# EasyEDA Pro project 中心板V3.0.epro

# Schematic Schematic1
Board Name: Board1; Create Date: 2024-10-14; Page Name: P1; Project Name: 中心板; Schematic Name: Schematic1; Update Date: 2024-11-11; Company: 嘉立创EDA; Page Size: A4; Version: V1.0
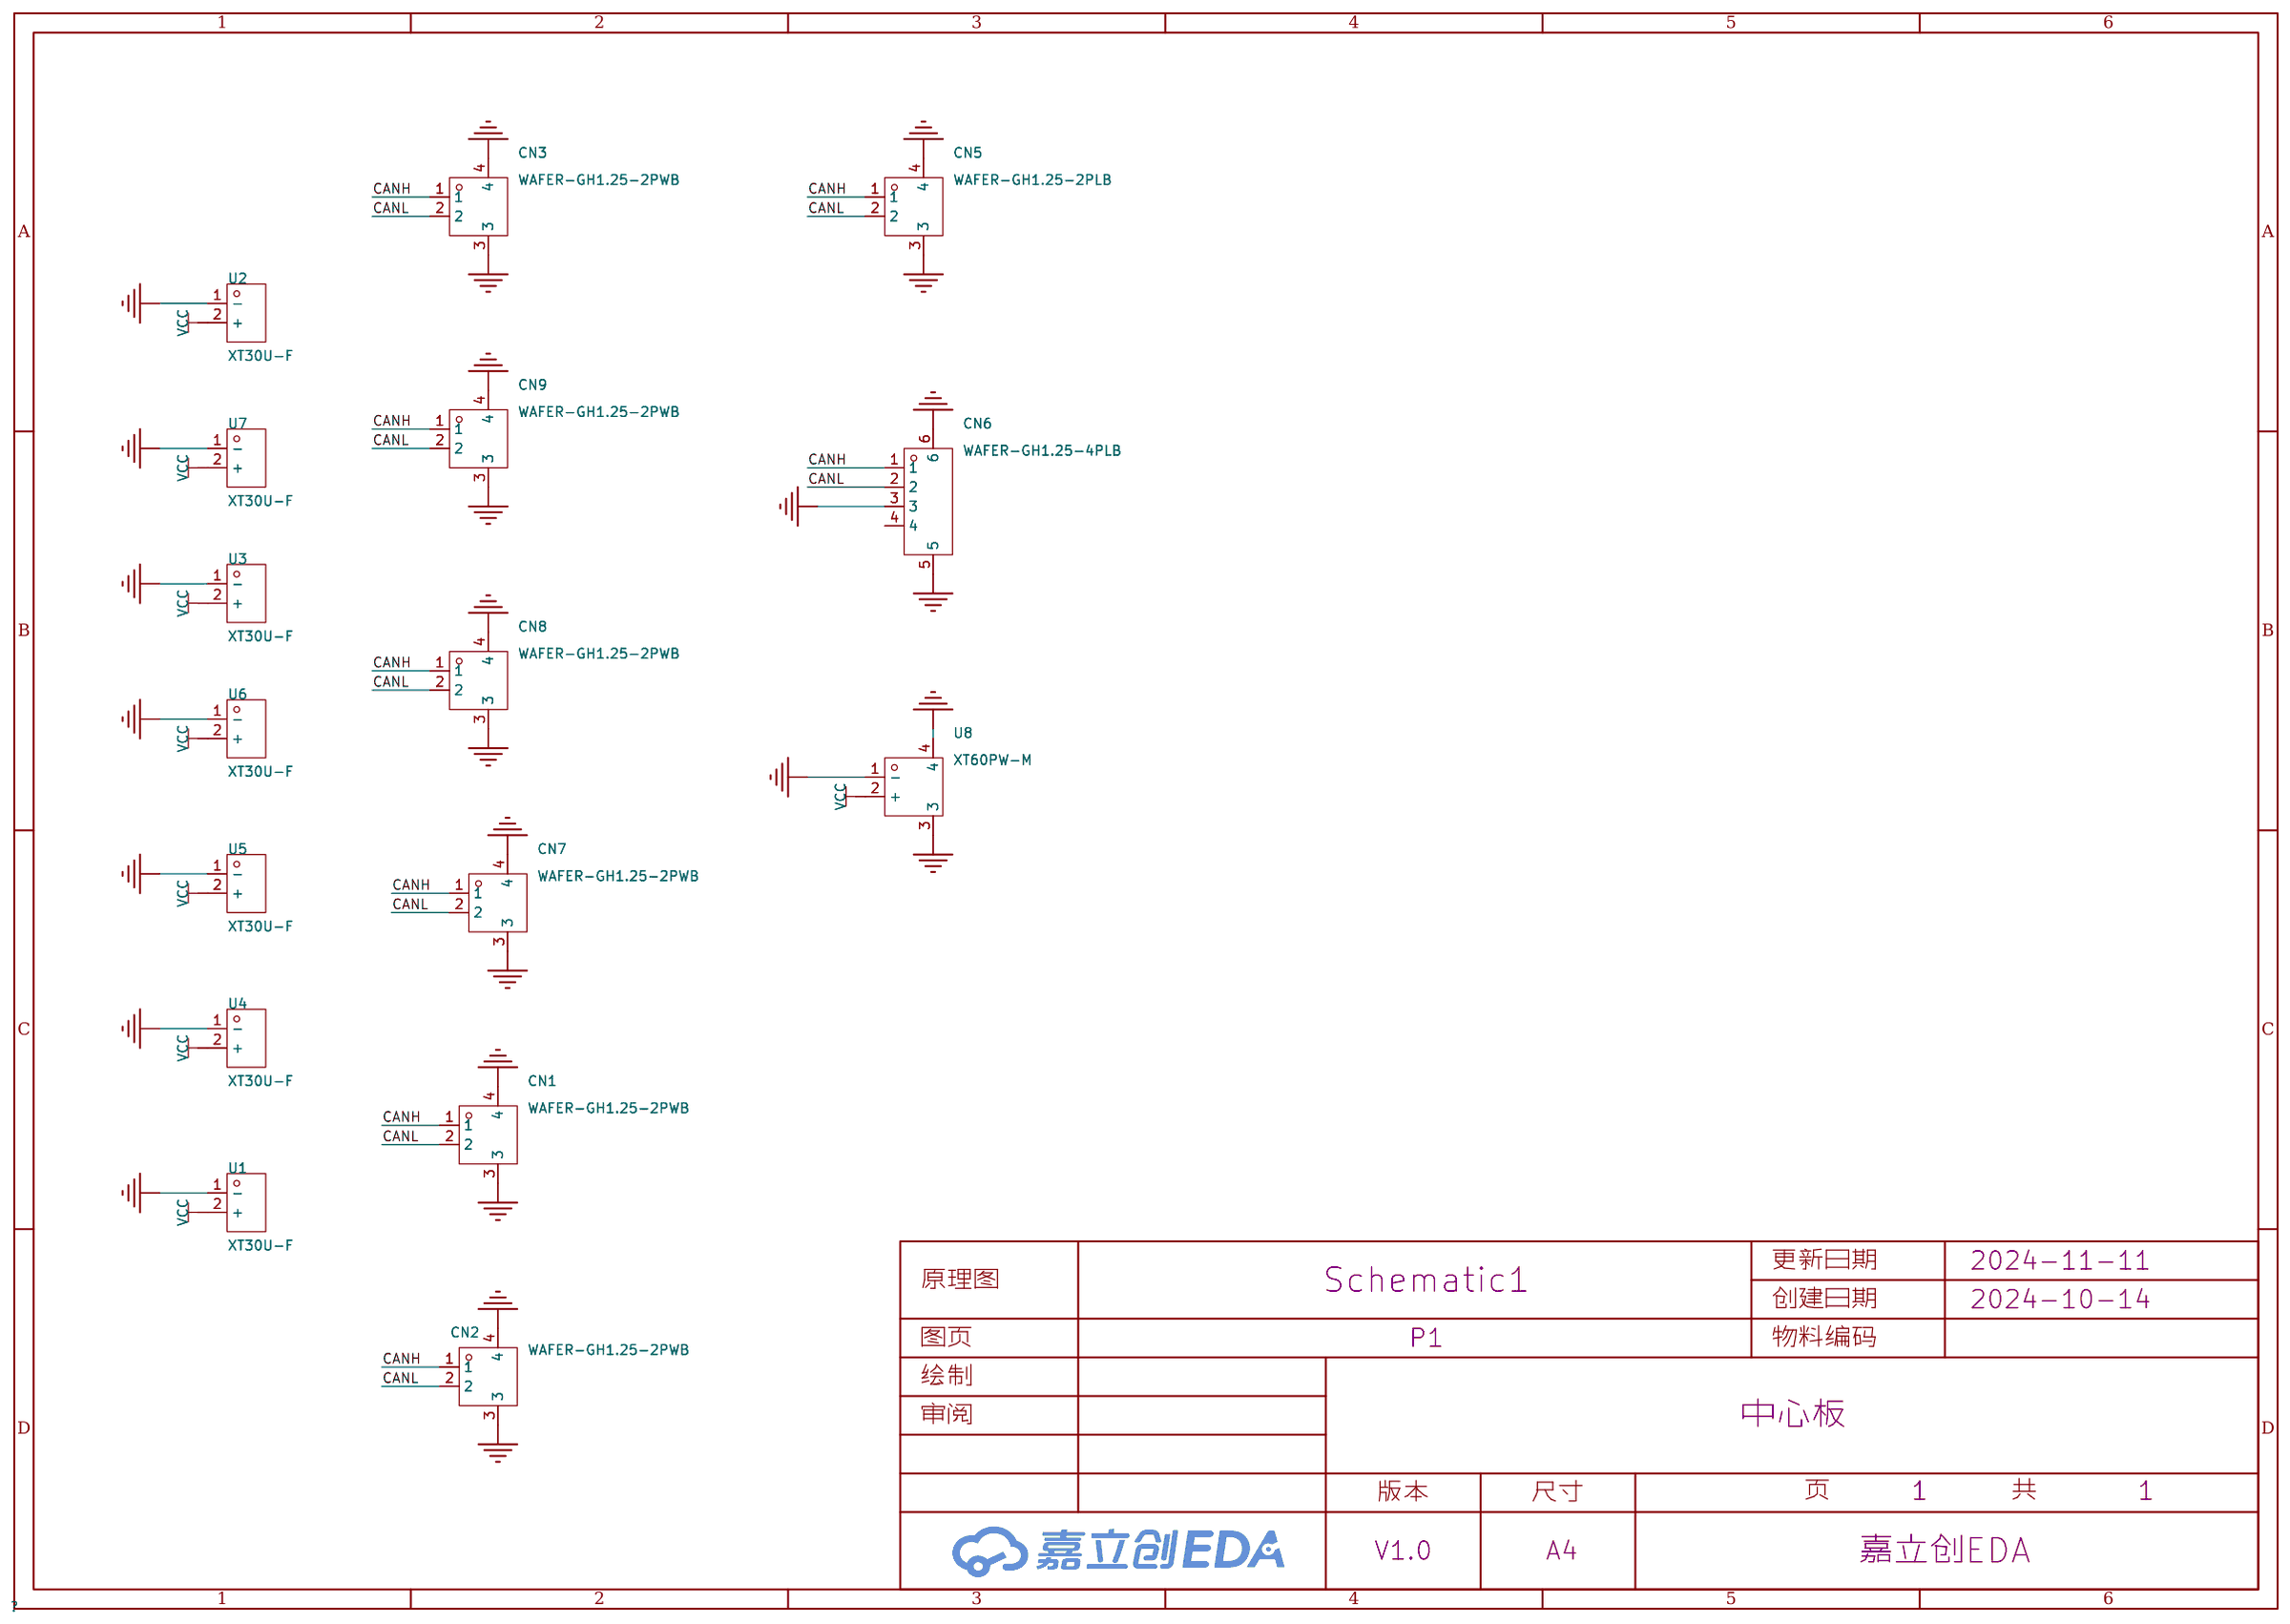
[diagram p0: schematic sheet]

## Parts
CN1  WAFER-GH1.25-2PWB  [CONN-TH_2P-P1.25_XUNPU_WAFER-GH1.25-2PWB]
CN2  WAFER-GH1.25-2PWB  [CONN-TH_2P-P1.25_XUNPU_WAFER-GH1.25-2PWB]
CN3  WAFER-GH1.25-2PWB  [CONN-TH_2P-P1.25_XUNPU_WAFER-GH1.25-2PWB]
CN5  WAFER-GH1.25-2PLB  [CONN-TH_2P-P1.25_XUNPU_WAFER-GH1.25-2PLB]
CN6  WAFER-GH1.25-4PLB  [CONN-SMD_4P-P1.25_XUNPU_WAFER-GH1.25-4PLB]
CN7  WAFER-GH1.25-2PWB  [CONN-TH_2P-P1.25_XUNPU_WAFER-GH1.25-2PWB]
CN8  WAFER-GH1.25-2PWB  [CONN-TH_2P-P1.25_XUNPU_WAFER-GH1.25-2PWB]
CN9  WAFER-GH1.25-2PWB  [CONN-TH_2P-P1.25_XUNPU_WAFER-GH1.25-2PWB]
U1  XT30U-F  [CONN-TH_XT30U-F]
U2  XT30U-F  [CONN-TH_XT30U-F]
U3  XT30U-F  [CONN-TH_XT30U-F]
U4  XT30U-F  [CONN-TH_XT30U-F]
U5  XT30U-F  [CONN-TH_XT30U-F]
U6  XT30U-F  [CONN-TH_XT30U-F]
U7  XT30U-F  [CONN-TH_XT30U-F]
U8  XT60PW-M  [CONN-TH_XT60PW-M]

## Library data of the parts
CN1-CN3 CN7-CN9 = WAFER-GH1.25-2PWB: 插针结构:1x2P;间距:1.25mm;安装方式:卧贴;参考系列:GH;总PIN数:2P;排数:1;每排PIN数:2;额定电流:1A;工作温度范围:-25℃~+85℃;; LCSC Part Name: 1x2P 间距:1.25mm 卧贴 系列:GH; Supplier Part: C3029377; Manufacturer: XUNPU(讯普); Supplier Footprint: SMD,P=1.25mm,卧贴; JLCPCB Part Class: 扩展库; Datasheet: https://atta.szlcsc.com/upload/public/pdf/source/20220527/CB8773BFB0913C3B8ABD62CB38BA101A.pdf; Supplier: LCSC; Pins Structure: 1x2P; Pitch: 1.25mm; Mounting Style: 卧贴; Reference Series: GH; Number of Pins: 2P; Number of Rows: 1; Number of PINs Per Row: 2; Current Rating (Max): 1A; Operating Temperature Range: -25℃~+85℃
CN5 = WAFER-GH1.25-2PLB: 插针结构:1x2P;间距:1.25mm;安装方式:立贴;参考系列:GH;总PIN数:2P;排数:1;每排PIN数:2;额定电流:1A;工作温度范围:-25℃~+85℃;; LCSC Part Name: 1x2P 间距:1.25mm 立贴 系列:GH; Supplier Part: C3029368; Manufacturer: XUNPU(讯普); Supplier Footprint: SMD,P=1.25mm; JLCPCB Part Class: 扩展库; Datasheet: https://atta.szlcsc.com/upload/public/pdf/source/20220527/44F824AAC8C2B617205E15955FF9C23D.pdf; Supplier: LCSC; Pins Structure: 1x2P; Pitch: 1.25mm; Mounting Style: 立贴; Reference Series: GH; Number of Pins: 2P; Number of Rows: 1; Number of PINs Per Row: 2; Current Rating (Max): 1A; Operating Temperature Range: -25℃~+85℃
CN6 = WAFER-GH1.25-4PLB: 插针结构:1x4P;间距:1.25mm;安装方式:立贴;参考系列:GH;总PIN数:4P;排数:1;每排PIN数:4;额定电流:1A;工作温度范围:-25℃~+85℃;; LCSC Part Name: 1x4P 间距:1.25mm 立贴 系列:GH; Supplier Part: C3029370; Manufacturer: XUNPU(讯普); Supplier Footprint: SMD,P=1.25mm; JLCPCB Part Class: 扩展库; Datasheet: https://atta.szlcsc.com/upload/public/pdf/source/20220527/44F824AAC8C2B617205E15955FF9C23D.pdf; Supplier: LCSC; Pins Structure: 1x4P; Pitch: 1.25mm; Mounting Style: 立贴; Reference Series: GH; Number of Pins: 4P; Number of Rows: 1; Number of PINs Per Row: 4; Current Rating (Max): 1A; Operating Temperature Range: -25℃~+85℃
U1-U7 = XT30U-F: 类别:-;类型1:-;; LCSC Part Name: AMASS(艾迈斯)轻量版锂电池插头母头 XT30U-F; Supplier Part: C99102; Manufacturer: AMASS(艾迈斯); JLCPCB Part Class: 扩展库; Datasheet: https://atta.szlcsc.com/upload/public/pdf/source/20190916/C428721_B0ECB8C5937139CEFE8736D2D3175B0E.pdf; Supplier: LCSC; Brand: 艾迈斯; Type: 插头; Colour: 黄色; InterfaceType: 母头
U8 = XT60PW-M: 类别:-;类型1:-;; LCSC Part Name: AMASS(艾迈斯)航模插头xt60连接器150公母对接pw锂电池公头 板插卧式XT60PW-M; Supplier Part: C98732; Manufacturer: AMASS(艾迈斯); JLCPCB Part Class: 扩展库; Datasheet: https://atta.szlcsc.com/upload/public/pdf/source/20240118/44A3DCFF53BE25DC65378AFFB21277A4.pdf; Supplier: LCSC; Brand: 艾迈斯; Type: 卧式插头; Colour: 黄色; InterfaceType: 公头

## Nets
GND: CN1.3 CN1.4 CN2.3 CN2.4 CN3.3 CN3.4 CN5.3 CN5.4 CN6.3 CN6.5 CN6.6 CN7.3 CN7.4 CN8.3 CN8.4 CN9.3 CN9.4 U1.1(-) U2.1(-) U3.1(-) U4.1(-) U5.1(-) U6.1(-) U7.1(-) U8.1(-) U8.3 U8.4
VCC: U1.2(+) U2.2(+) U3.2(+) U4.2(+) U5.2(+) U6.2(+) U7.2(+) U8.2(+)
CANH: CN1.1 CN2.1 CN3.1 CN5.1 CN6.1 CN7.1 CN8.1 CN9.1
CANL: CN1.2 CN2.2 CN3.2 CN5.2 CN6.2 CN7.2 CN8.2 CN9.2

Not connected (* = marked no-connect by the designer): CN6 4

# Board PCB1
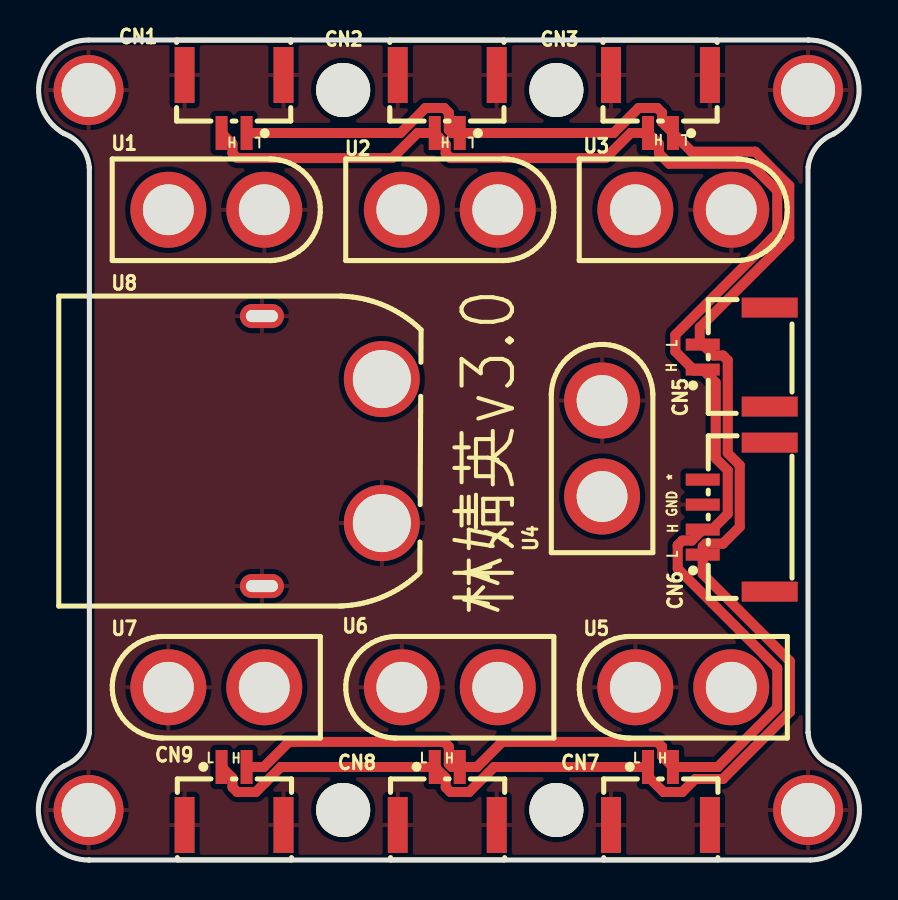
[diagram p1: board, top side]
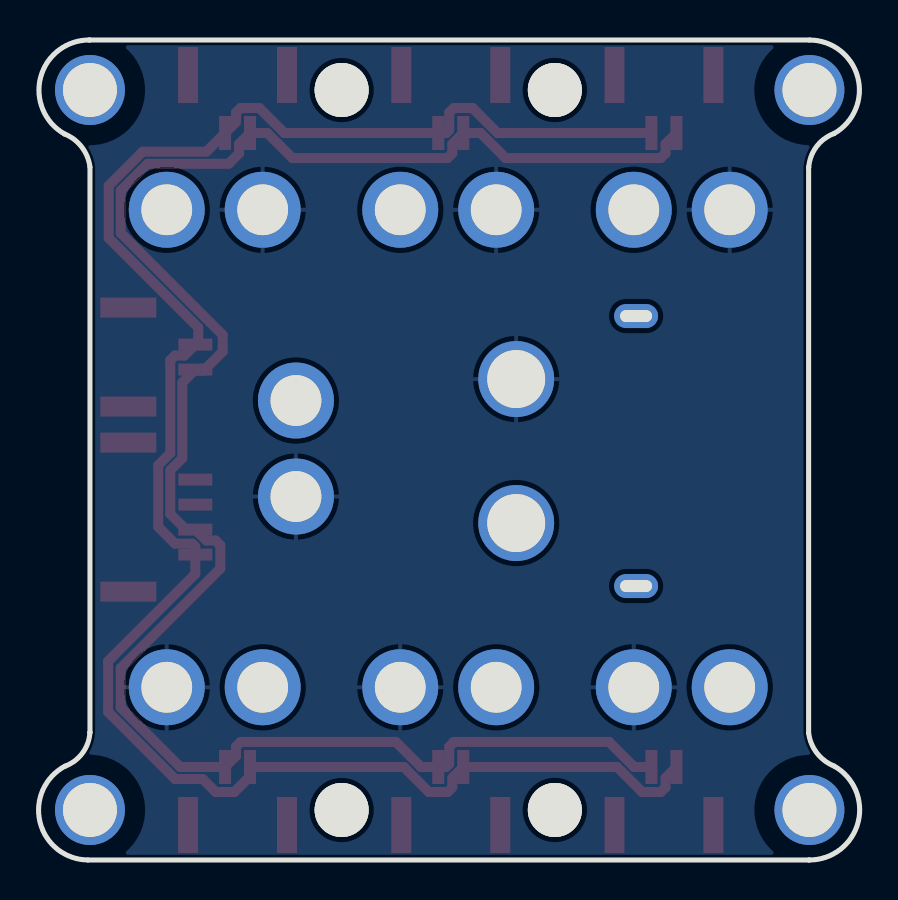
[diagram p2: board, bottom side, seen from below]

Outline 41.09 x 41 mm; copper layers: Top Layer, Bottom Layer. Coordinates in mm from the lower left corner of the outline.
Outline path: 1.28,36.32 arc(0.09,39.14) 2.51,41 38.51,41 38.55,41 arc(40.99,39.13) 39.78,36.3 arc(38.92,35.65) 38.51,34.65 38.51,6.37 38.52,6.37 arc(38.89,5.35) 39.76,4.69 arc(41.02,1.9) 38.62,0 2.55,0 2.51,0 arc(0.08,1.87) 1.28,4.7 arc(2.14,5.35) 2.55,6.35 2.55,34.63 2.55,34.63 arc(2.17,35.66) 1.28,36.32
Stack: Top Layer 0.035mm / Dielectric1 1.51mm FR4 er 4.5 / Bottom Layer 0.035mm

## Design rules (mm)
template: JLCPCB Capability(Two Layers Board)
spacing copperThickness1oz (default): track to track 0.102, other pairs 0.152 to 0.3
spacing copperThickness2oz: track to track 0.203, other pairs 0.152 to 0.3
track width copperThickness1oz (default): min 0.127, default 0.254, max 2.54
track width copperThickness2oz: min 0.203, default 0.254, max 2.54
differential pair differentialPair (default): width min 0.127, default 0.254, max 2.54; gap min 0.152, default 0.152
via viaSize (default): diameter min 0.5, default 0.61, max 10; hole min 0.3, default 0.305, max 6.3

## Placement (name value [footprint] x y rotation side)
CN1  WAFER-GH1.25-2PWB  [CONN-TH_2P-P1.25_XUNPU_WAFER-GH1.25-2PWB]  9.79 37.8 180 top
CN2  WAFER-GH1.25-2PWB  [CONN-TH_2P-P1.25_XUNPU_WAFER-GH1.25-2PWB]  20.46 37.8 180 top
CN3  WAFER-GH1.25-2PWB  [CONN-TH_2P-P1.25_XUNPU_WAFER-GH1.25-2PWB]  31.13 37.8 180 top
CN5  WAFER-GH1.25-2PLB  [CONN-TH_2P-P1.25_XUNPU_WAFER-GH1.25-2PLB]  34.92 25.15 90 top
CN6  WAFER-GH1.25-4PLB  [CONN-SMD_4P-P1.25_XUNPU_WAFER-GH1.25-4PLB]  34.92 17.15 90 top
CN7  WAFER-GH1.25-2PWB  [CONN-TH_2P-P1.25_XUNPU_WAFER-GH1.25-2PWB]  31.13 3.2 0 top
CN8  WAFER-GH1.25-2PWB  [CONN-TH_2P-P1.25_XUNPU_WAFER-GH1.25-2PWB]  20.46 3.2 0 top
CN9  WAFER-GH1.25-2PWB  [CONN-TH_2P-P1.25_XUNPU_WAFER-GH1.25-2PWB]  9.79 3.2 0 top
NOREF  -  [Pad_e102]  25.92 38.5 0 top
NOREF#2  -  [Pad_e64]  15.25 2.5 0 top
NOREF#3  -  [Pad_e103]  15.25 38.5 0 top
NOREF#4  -  [Pad_e101]  25.92 2.5 0 top
NOREF#5  -  [Pad_e710]  2.51 2.5 0 top
NOREF#6  -  [Pad_e711]  38.51 2.5 0 top
NOREF#7  -  [Pad_e709]  38.51 38.5 0 top
NOREF#8  -  [Pad_e707]  2.51 38.5 0 top
U1  XT30U-F  [CONN-TH_XT30U-F]  8.9 32.51 0 top
U2  XT30U-F  [CONN-TH_XT30U-F]  20.59 32.51 0 top
U3  XT30U-F  [CONN-TH_XT30U-F]  32.27 32.51 0 top
U4  XT30U-F  [CONN-TH_XT30U-F]  28.21 20.57 90 top
U5  XT30U-F  [CONN-TH_XT30U-F]  32.27 8.64 180 top
U6  XT30U-F  [CONN-TH_XT30U-F]  20.59 8.64 180 top
U7  XT30U-F  [CONN-TH_XT30U-F]  8.9 8.64 180 top
U8  XT60PW-M  [CONN-TH_XT60PW-M]  14.19 20.45 0 top

## Footprints (pads in the part's own frame, mm; a bottom-side part is the same pattern mirrored in y, then rotated)
CONN-SMD_4P-P1.25_XUNPU_WAFER-GH1.25-4PLB
  rect 0.6x1.7 smd: 1(-1.875,1.675) 2(-0.625,1.675) 3(0.625,1.675) 4(1.875,1.675)
  rect 1x2.8 smd: 5(-3.725,-1.675) 6(3.725,-1.675)
CONN-TH_2P-P1.25_XUNPU_WAFER-GH1.25-2PLB
  rect 0.6x1.7 smd: 1(-0.625,1.675) 2(0.625,1.675)
  rect 1x2.8 smd: 3(2.475,-1.675) 4(-2.475,-1.675)
CONN-TH_2P-P1.25_XUNPU_WAFER-GH1.25-2PWB
  rect 0.6x1.7 smd: 1(-0.625,1.45) 2(0.625,1.45)
  rect 1x2.8 smd: 3(-2.475,-1.45) 4(2.475,-1.45)
CONN-TH_XT30U-F
  round 3.8 hole 2.54: 1(2.4,0) 2(-2.4,0)
CONN-TH_XT60PW-M
  round 3.8 hole 2.9: 1(3,-3.6) 2(3,3.6)
  oval 2.2x1.2 hole 1.6x0.6: 3(-3,6.75) 4(-3,-6.75)
Pad_e64
  round 2.7 hole 2.7: 2(0,0)
Pad_e101
  round 2.7 hole 2.7: 2(0,0)
Pad_e102
  round 2.7 hole 2.7: 2(0,0)
Pad_e103
  round 2.7 hole 2.7: 2(0,0)
Pad_e707
  round 3.5 hole 2.7: 1(0,0)
Pad_e709
  round 3.5 hole 2.7: 1(0,0)
Pad_e710
  round 3.5 hole 2.7: 1(0,0)
Pad_e711
  round 3.5 hole 2.7: 1(0,0)

## Nets
GND: CN1.3 CN1.4 CN2.3 CN2.4 CN3.3 CN3.4 CN6.3 CN7.3 CN7.4 CN8.3 CN8.4 CN9.3 CN9.4 NOREF#5.1 NOREF#6.1 NOREF#7.1 NOREF#8.1 U1.1 U2.1 U3.1 U4.1 U5.1 U6.1 U7.1 U8.1 U8.3 U8.4
VCC: U1.2 U2.2 U3.2 U4.2 U5.2 U6.2 U7.2 U8.2
CANH: CN1.1 CN2.1 CN3.1 CN5.2 CN6.1 CN7.1 CN8.1 CN9.1
CANL: CN1.2 CN2.2 CN3.2 CN5.1 CN6.2 CN7.2 CN8.2 CN9.2

Pads without a net: CN5 3 4; CN6 4 5 6; NOREF 2; NOREF#2 2; NOREF#3 2; NOREF#4 2

## Routing (per net, layer and track width the routed paths; a pad name or vN(x,y) marks a point on that pad's centre or on a via; arc(x,y) is an arc through that point)
CANH: length 97
  Top Layer w0.5: CN9.1 9.72,4.1 9.72,3.63 9.95,3.4 10.88,3.4 12.14,4.65 CN8.1 20.38,4.1 20.38,3.63 20.62,3.4 21.55,3.4 22.8,4.65 CN7.1 30.5,4.18 31.29,3.4 32.22,3.4 32.87,4.05 34.25,4.05 37.61,7.4 37.61,9.94 33.24,14.3 CN6.1 33.24,15.67 33.39,15.82 34.26,15.82 35.1,16.66 35.1,19.74 34.49,20.34 34.49,24.99 34.26,25.22 33.79,25.22 CN5.2 33.1,25.92 33.1,26.63 37.58,31.1 37.58,33.72 35.87,35.42 32.69,35.42 CN3.1 31.21,36.9 31.21,37.37 30.97,37.6 30.04,37.6 28.78,36.35 CN2.1 20.69,36.35 20.54,36.5 20.54,37.37 20.3,37.6 19.37,37.6 18.12,36.35 CN1.1
CANL: length 95.5
  Top Layer w0.5: CN1.2 9.71,35.8 9.71,35.33 9.95,35.1 17.71,35.1 18.97,36.35 CN2.2 20.38,35.8 20.38,35.33 20.62,35.1 28.38,35.1 29.63,36.35 CN3.2 31.05,35.8 31.05,35.33 31.57,34.81 35.62,34.81 36.97,33.47 36.97,31.35 31.87,26.25 31.87,25.42 32.82,24.47 33.19,24.47 CN5.1 33.89,23.87 33.89,20.09 34.49,19.49 34.49,17.3 33.71,16.52 CN6.2 32.69,15.97 32.22,15.97 31.99,15.74 31.99,14.57 36.97,9.59 36.97,7.62 34,4.65 CN7.2 31.2,5.2 31.2,5.67 30.97,5.9 23.2,5.9 21.95,4.65 CN8.2 20.69,4.65 20.54,4.8 20.54,5.67 20.3,5.9 12.53,5.9 11.28,4.65 CN9.2

## Copper pours and planes (outline as drawn; the poured copper is in the pictures)
GND on Top Layer: -3.16,42.42 42.69,42.42 42.69,-3.94 -3.16,-3.94
GND on Bottom Layer: -3.42,44.2 43.7,44.2 43.7,-4.7 -3.42,-4.7
VCC on Top Layer: -3.16,42.67 43.83,42.67 43.83,-3.68 -3.16,-3.68
VCC on Bottom Layer: -3.16,42.67 43.19,42.67 43.19,-3.81 -3.16,-3.81

## Text on the board
Top Silkscreen Layer: H | GND | L | * | 林婧英v3.0
